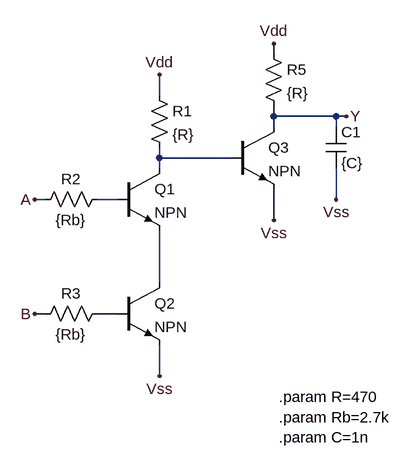
[diagram p0: schematic and.asc]
and.asc, the LTspice schematic file:
Version 4
SHEET 1 880 680
WIRE -64 -224 -64 -240
WIRE -240 -160 -240 -192
WIRE -64 -128 -64 -144
WIRE 32 -128 -64 -128
WIRE 48 -128 32 -128
WIRE -64 -112 -64 -128
WIRE 32 -112 32 -128
WIRE -240 -64 -240 -80
WIRE -128 -64 -240 -64
WIRE -240 -48 -240 -64
WIRE -416 0 -432 0
WIRE -304 0 -336 0
WIRE 32 0 32 -48
WIRE -64 32 -64 -16
WIRE -240 128 -240 48
WIRE -416 176 -432 176
WIRE -304 176 -336 176
WIRE -240 272 -240 224
FLAG -240 272 Vss
FLAG -240 -192 Vdd
FLAG -432 176 B
FLAG -432 0 A
FLAG 32 0 Vss
FLAG -64 32 Vss
FLAG -64 -240 Vdd
FLAG 48 -128 Y
SYMBOL npn -304 -48 R0
SYMATTR InstName Q1
SYMBOL npn -304 128 R0
SYMATTR InstName Q2
SYMBOL res -256 -176 R0
SYMATTR InstName R1
SYMATTR Value {R}
SYMBOL res -320 -16 R90
WINDOW 0 0 56 VBottom 2
WINDOW 3 32 56 VTop 2
SYMATTR InstName R2
SYMATTR Value {Rb}
SYMBOL res -320 160 R90
WINDOW 0 0 56 VBottom 2
WINDOW 3 32 56 VTop 2
SYMATTR InstName R3
SYMATTR Value {Rb}
SYMBOL cap 16 -112 R0
SYMATTR InstName C1
SYMATTR Value {C}
SYMBOL npn -128 -112 R0
SYMATTR InstName Q3
SYMBOL res -80 -240 R0
SYMATTR InstName R5
SYMATTR Value {R}
TEXT -56 304 Left 2 !.param R=470\n.param Rb=2.7k\n.param C=1n

The netlist it stands for:
* and.asc
Q1 N001 N002 N003 0 NPN
Q2 N003 N004 Vss 0 NPN
R1 Vdd N001 {R}
R2 N002 A {Rb}
R3 N004 B {Rb}
C1 Y Vss {C}
Q3 Y N001 Vss 0 NPN
R5 Vdd Y {R}
.model NPN NPN
.model PNP PNP
.lib standard.bjt
.param R=470
.param Rb=2.7k
.param C=1n
.backanno
.end